# EAGLE design ATSAMR21-Breakout (EAGLE 7.2.0)
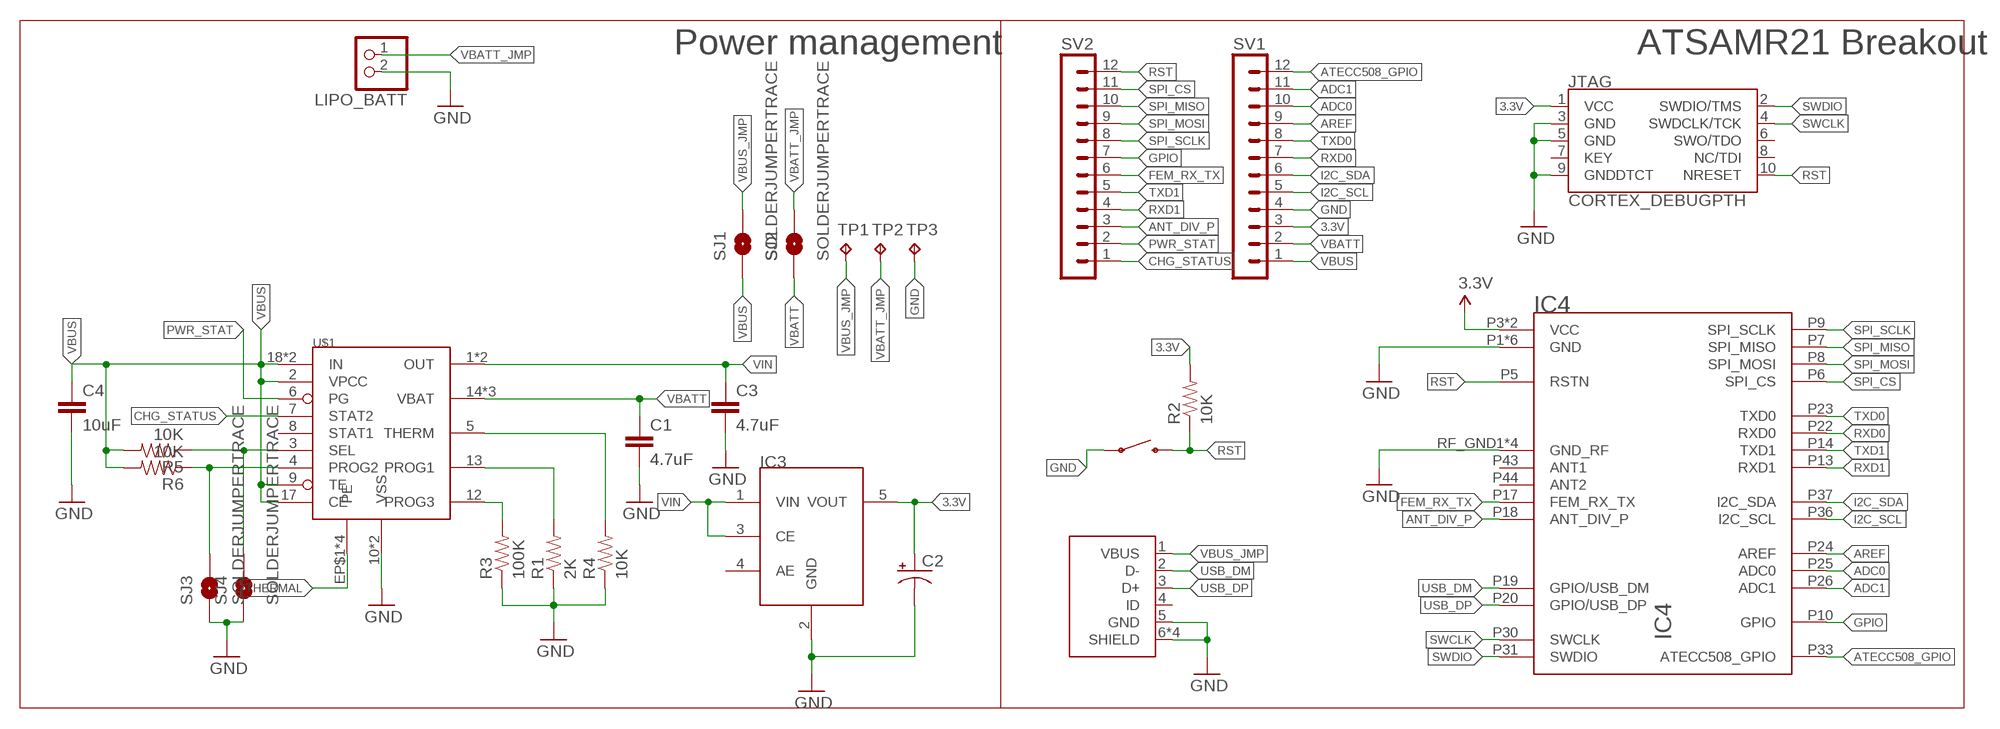
[diagram p0: schematic, sheet 1]

## Parts
C1  4.7uF  22UF-0805-6.3V-20%  [0805]
C2  47uF  TPSB107M010R0400  [1210-POLARIZED]
C3  4.7uF  22UF-0805-6.3V-20%  [0805]
C4  10uF  22UF-0805-6.3V-20%  [0805]
IC3  NCP4589DSN33T1G  [SOT23-5]
IC4  ATSAMR21G18-MR210UA  [ATSAMR21G18A-MR210UA]
JTAG  CORTEX_DEBUGPTH  [2X5-PTH-1.27MM]
LIPO_BATT  JST_2PIN-THM-RA  [JST-PH-2-THM-RA]
R1  2K  RESISTOR0805-RES  [0805]
R2  10K  RESISTOR0805-RES  [0805]
R3  100K  RESISTOR0805-RES  [0805]
R4  10K  RESISTOR0805-RES  [0805]
R5  10K  RESISTOR0805-RES  [0805]
R6  10K  RESISTOR0805-RES  [0805]
S1  EVQ-PNF04M  [PANASONIC_EVQPE1/PN/5P]
SJ1  SOLDERJUMPERTRACE  [SJ_2S-TRACE]
SJ2  SOLDERJUMPERTRACE  [SJ_2S-TRACE]
SJ3  SOLDERJUMPERTRACE  [SJ_2S-TRACE]
SJ4  SOLDERJUMPERTRACE  [SJ_2S-TRACE]
SV1  MA12-1  [MA12-1]
SV2  MA12-1  [MA12-1]
TP1  TPB2,54  [B2,54]
TP2  TPB2,54  [B2,54]
TP3  TPB2,54  [B2,54]
U$1  MCP73871T  [QFN-20]
USB_CONN  USB-MICRO-B  [HPL511]

## Nets
3.3V: C2.1(+) IC3.5(VOUT) IC4.P3(VCC) IC4.P4(VCC) JTAG.1(VCC) R2.2 SV1.3
ADC0: IC4.P25(ADC0) SV1.10
ADC1: IC4.P26(ADC1) SV1.11
ANT_DIV_P: IC4.P18(ANT_DIV_P) SV2.3
AREF: IC4.P24(AREF) SV1.9
ATECC508_GPIO: IC4.P33(ATECC508_GPIO) SV1.12
CHG_STATUS: SV2.1 U$1.7(STAT2)
FEM_RX_TX: IC4.P17(FEM_RX_TX) SV2.6
GND: C1.2 C2.2(-) C3.2 C4.2 IC3.2(GND) IC4.P1(GND) IC4.P2(GND) IC4.P12(GND) IC4.P29(GND) IC4.P41(GND) IC4.P42(GND) IC4.RF_GND1(GND_RF) IC4.RF_GND2(GND_RF) IC4.RF_GND3(GND_RF) IC4.RF_GND4(GND_RF) JTAG.3(GND) JTAG.5(GND) JTAG.9(GNDDTCT) LIPO_BATT.2 R1.1 R3.1 R4.1 S1.P1 SJ3.1 SJ4.1 SV1.4 TP3.TP U$1.10(VSS) U$1.11(VSS) USB_CONN.5(GND) USB_CONN.6(SHIELD) USB_CONN.7(SHIELD) USB_CONN.8(SHIELD) USB_CONN.9(SHIELD)
GPIO: IC4.P10(GPIO) SV2.7
I2C_SCL: IC4.P36(I2C_SCL) SV1.5
I2C_SDA: IC4.P37(I2C_SDA) SV1.6
N$1: R6.1 SJ3.2 U$1.4(PROG2)
N$2: R5.1 SJ4.2 U$1.3(SEL)
N$3: R3.2 U$1.12(PROG3)
N$4: R1.2 U$1.13(PROG1)
N$5: R4.2 U$1.5(THERM)
PWR_STAT: SV2.2 U$1.6(PG)
RST: IC4.P5(RSTN) JTAG.10(NRESET) R2.1 S1.P2 SV2.12
RXD0: IC4.P22(RXD0) SV1.7
RXD1: IC4.P13(RXD1) SV2.4
SPI_CS: IC4.P6(SPI_CS) SV2.11
SPI_MISO: IC4.P7(SPI_MISO) SV2.10
SPI_MOSI: IC4.P8(SPI_MOSI) SV2.9
SPI_SCLK: IC4.P9(SPI_SCLK) SV2.8
SWCLK: IC4.P30(SWCLK) JTAG.4(SWDCLK/TCK)
SWDIO: IC4.P31(SWDIO) JTAG.2(SWDIO/TMS)
THERMAL: U$1.EP$1(PE) U$1.EP$2(PE) U$1.EP$3(PE) U$1.EP$4(PE)
TXD0: IC4.P23(TXD0) SV1.8
TXD1: IC4.P14(TXD1) SV2.5
USB_DM: IC4.P19(GPIO/USB_DM) USB_CONN.2(D-)
USB_DP: IC4.P20(GPIO/USB_DP) USB_CONN.3(D+)
VBATT: C1.1 SJ2.1 SV1.2 U$1.14(VBAT) U$1.15(VBAT) U$1.16(VBAT)
VBATT_JMP: LIPO_BATT.1 SJ2.2 TP2.TP
VBUS: C4.1 R5.2 R6.2 SJ1.1 SV1.1 U$1.2(VPCC) U$1.9(TE) U$1.17(CE) U$1.18(IN) U$1.19(IN)
VBUS_JMP: SJ1.2 TP1.TP USB_CONN.1(VBUS)
VIN: C3.1 IC3.1(VIN) IC3.3(CE) U$1.1(OUT) U$1.20(OUT)
Unconnected: IC3.4(AE) IC4.P43(ANT1) IC4.P44(ANT2) JTAG.6(SWO/TDO) JTAG.7(KEY) JTAG.8(NC/TDI) U$1.8(STAT1) USB_CONN.4(ID)

## Notes on the sheet
- Power management | ATSAMR21 Breakout

## Library data of the parts
C1 C3 C4 = SparkFun-Capacitors:22UF: 22µF ceramic capacitors A capacitor is a passive two-terminal electrical component used to store electrical energy temporarily in an electric field.; PROD_ID: CAP-08402; VALUE: 22uF
C2 = custom_componentsv0.9:TPSB107M010R0400
IC3 = radios:NCP4589DSN33T1G
IC4 = radios:ATSAMR21G18-MR210UA
JTAG = SparkFun-Connectors:CORTEX_DEBUG: Cortex Debug Connector Datasheet <http://infocenter.arm.com/help/topic/com.arm.doc.faqs/attached/13634/cortex_debug_connectors.pdf>
LIPO_BATT = adafruit:JST_2PIN: JST 2-Pin Connectors of various flavors SMT-RA (S2B-PH-SM4) 4UConnector #17311 SMT (B2B-PH-SM4) THM-RA (S2B-PH) THM (B2B-PH)
R1-R6 = SparkFun-Resistors:RESISTOR: Resistor Basic schematic elements and footprints for 0603, 1206, and PTH resistors.
S1 = radios:EVQ-PNF04M
SJ1-SJ4 = SparkFun-Retired:SOLDERJUMPER: Solder Jumper Standard SMD solder jumper. Used to automate production. Two varients : Normally Open and Normally Closed are the same, but have different paste layers. NC will have a large amount of paste and should jumper during reflow.
SV1 SV2 = con-lstb:MA12-1: PIN HEADER; OC_FARNELL: unknown; OC_NEWARK: unknown
TP1-TP3 = testpad:TP: Test pad
U$1 = radios:MCP73871T
USB_CONN = gpsinfopatch:USB-MICRO-B

## Board
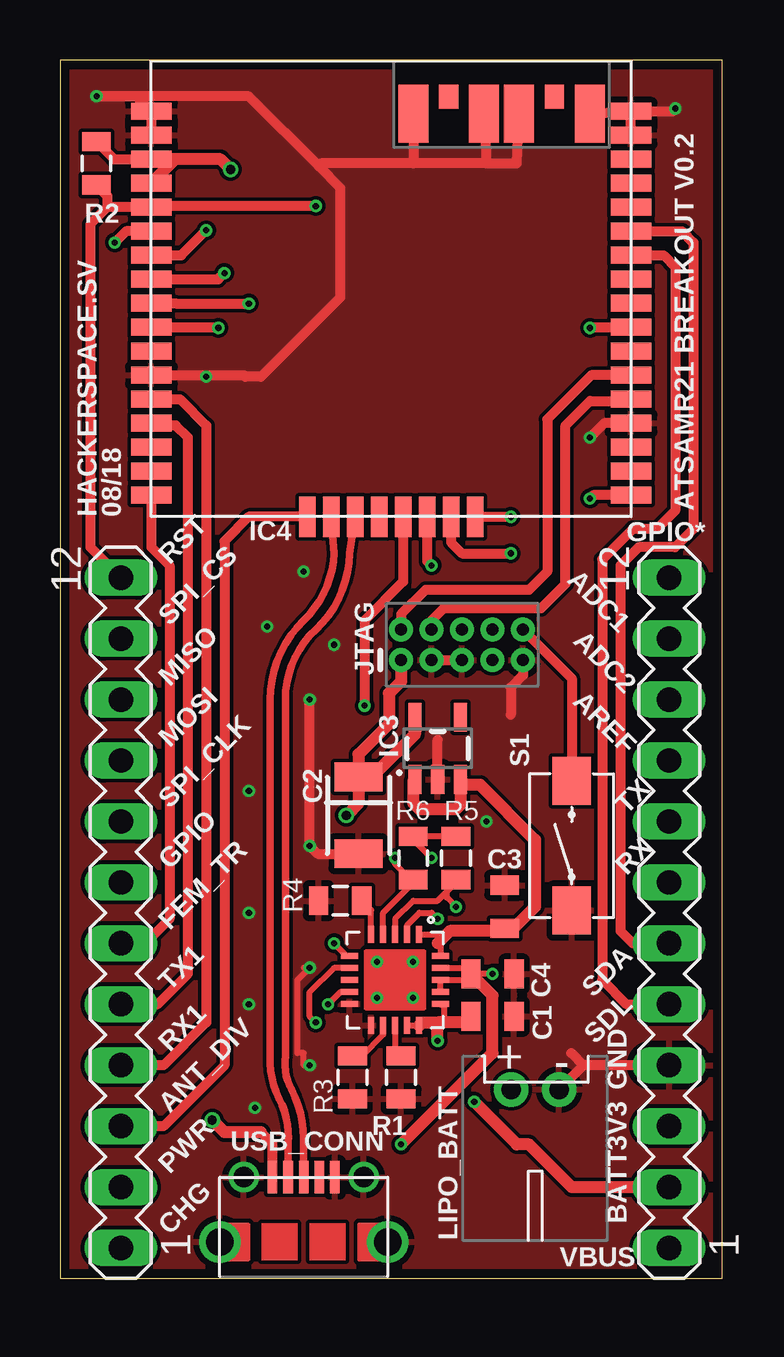
[diagram p1: board, top side]
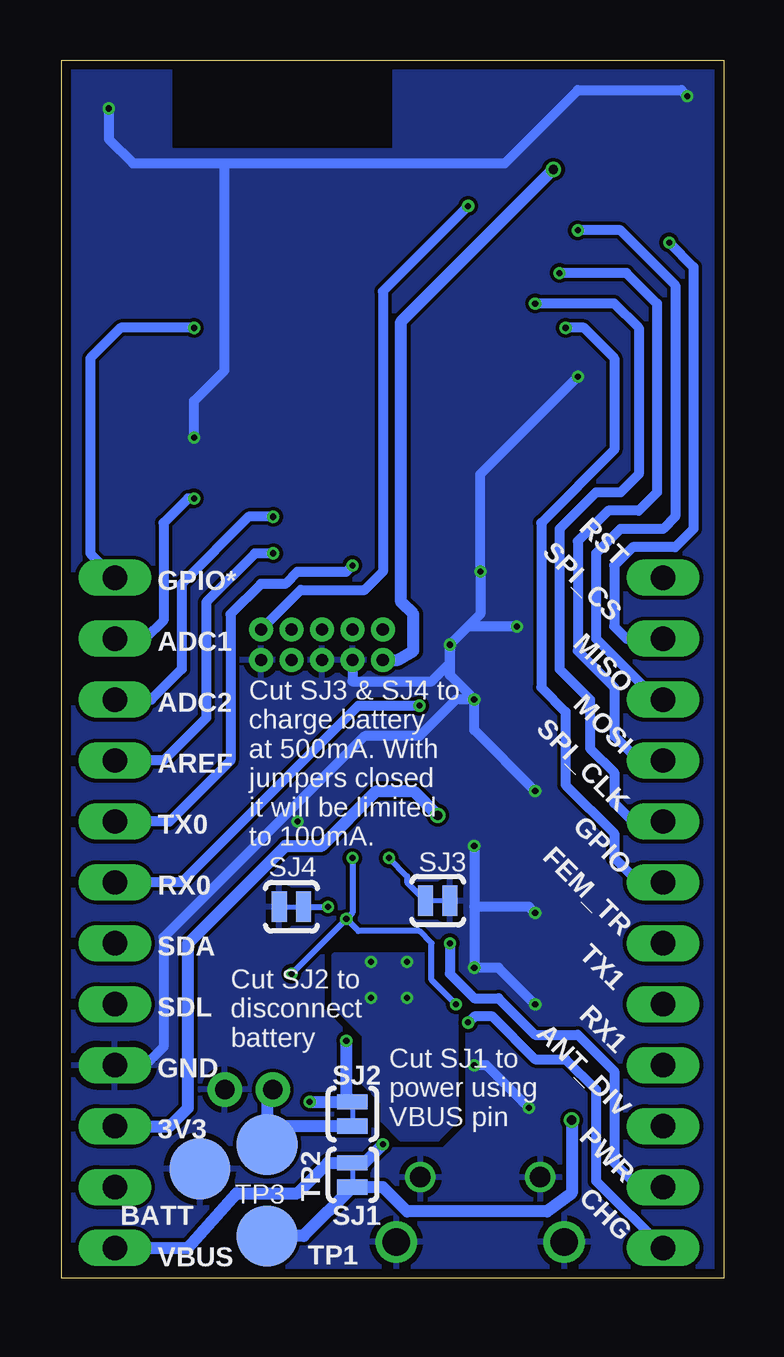
[diagram p2: board, bottom side, seen from below]

Size 27.61 x 50.79 mm. Coordinates in mm from the lower left corner, seen from the top.
Outline: 0,0 27.61,0 27.61,50.79 0,50.79 0,0
Copper layers (1*16): Top 0.035559375mm / dielectric 1.6mm / Bottom 0.035559375mm
Design rules "oshpark-2layer": minimum track width 6mil, minimum drill 10mil, track to track 6mil, track to pad 6mil, pad to pad 6mil, via to via 6mil, smd to smd 6mil, copper to edge 15mil, drill to drill 6mil, minimum pad ring 5mil, minimum via ring 5mil, stop-mask expansion 2.5mil, vias tented up to drill 0mil, thermal gap 10mil

### Footprints (pad centres in the part's own frame; a part is rotated, then mirrored left to right if it is on the bottom)
0805 = smd 0.8 x 1.2: 1 -0.9,0; 2 0.9,0
1210-POLARIZED = smd 1.2 x 2: 1 -1.6,0; 2 1.6,0
SOT23-5 = smd 0.55 x 1.2: 1 -0.95,-1.3; 2 0,-1.3; 3 0.95,-1.3; 4 0.95,1.3; 5 -0.95,1.3
ATSAMR21G18A-MR210UA = smd 1.7 x 0.7: P1 0,16.9; P2 0,15.9; P3 0,14.9; P4 0,13.9; P5 0,12.9; P6 0,11.9; P7 0,10.9; P8 0,9.9; P9 0,8.9; P10 0,7.9; P11 0,6.9; P12 0,5.9; P13 0,4.9; P14 0,3.9; P15 0,2.9; P16 0,1.9; P17 0,0.9; P26 20,0.9; P27 20,1.9; P28 20,2.9; P29 20,3.9; P30 20,4.9; P31 20,5.9; P32 20,6.9; P33 20,7.9; P34 20,8.9; P35 20,9.9; P36 20,10.9; P37 20,11.9; P38 20,12.9; P39 20,13.9; P40 20,14.9; P41 20,15.9; P42 20,16.9 | smd 0.7 x 1.7: P18 6.5,0; P19 7.5,0; P20 8.5,0; P21 9.5,0; P22 10.5,0; P23 11.5,0; P24 12.5,0; P25 13.5,0 | smd 0.8 x 1: P43 16.8,17.5; P44 12.4,17.5 | smd 1.25 x 2.4: RF_GND1 18.275,16.8; RF_GND2 15.325,16.8; RF_GND3 13.875,16.8; RF_GND4 10.925,16.8
2X5-PTH-1.27MM = drill 0.508 pad 1: 1 -2.54,-0.635; 2 -2.54,0.635; 3 -1.27,-0.635; 4 -1.27,0.635; 5 0,-0.635; 6 0,0.635; 7 1.27,-0.635; 8 1.27,0.635; 9 2.54,-0.635; 10 2.54,0.635
JST-PH-2-THM-RA = drill 0.8 pad 1.422: 1 1,0; 2 -1,0
PANASONIC_EVQPE1/PN/5P = smd 2 x 1.6: P1 -2.7,0; P2 2.7,0
SJ_2S-TRACE = smd 0.635 x 1.27: 1 -0.508,0; 2 0.508,0
MA12-1 = drill 1.016 long: 1 -13.97,0; 2 -11.43,0; 3 -8.89,0; 4 -6.35,0; 5 -3.81,0; 6 -1.27,0; 7 1.27,0; 8 3.81,0; 9 6.35,0; 10 8.89,0; 11 11.43,0; 12 13.97,0
B2,54 = smd 2.54 x 2.54: TP 0,0
QFN-20 = smd 0.7 x 0.25: 1 -1.9,1; 2 -1.9,0.5; 3 -1.9,0; 4 -1.9,-0.5; 5 -1.9,-1; 11 1.9,-1; 12 1.9,-0.5; 13 1.9,0; 14 1.9,0.5; 15 1.9,1 | smd 0.25 x 0.7: 6 -1,-1.9; 7 -0.5,-1.9; 8 0,-1.9; 9 0.5,-1.9; 10 1,-1.9; 16 1,1.9; 17 0.5,1.9; 18 0,1.9; 19 -0.5,1.9; 20 -1,1.9 | drill 0.254 pad 0.381: EP$1 -0.75,0.75; EP$2 -0.75,-0.75; EP$3 0.75,-0.75; EP$4 0.75,0.75
HPL511 = smd 0.4 x 1.35: 1 -1.3,2.7; 2 -0.65,2.7; 3 0,2.7; 4 0.65,2.7; 5 1.3,2.7 | drill 1.15 pad 1.55: 6 -3.5,0; 7 3.5,0 | drill 0.85 pad 1.25: 8 -2.5,2.7; 9 2.5,2.7

### Placement (x,y rotation side)
C1  18.03,10.92 0 top
C2  12.45,19.3 270 top
C3  18.54,15.49 90 top
C4  18.03,12.7 0 top
IC3  15.75,22.1 0 top
IC4  3.81,31.75 0 top
JTAG  16.76,26.42 0 top
LIPO_BATT  19.81,7.87 180 top
R1  14.22,8.38 90 top
R2  1.52,46.48 90 top
R3  12.19,8.38 90 top
R4  11.68,15.75 0 top
R5  16.51,17.53 90 top
R6  14.73,17.53 90 top
S1  21.34,18.03 90 top
SJ1  15.49,4.32 270 bottom
SJ2  15.49,6.86 270 bottom
SJ3  11.94,15.75 180 bottom
SJ4  18.03,15.49 0 bottom
SV1  25.4,15.24 90 top
SV2  2.54,15.24 90 top
TP1  19.05,1.78 0 bottom
TP2  19.05,5.59 0 bottom
TP3  21.84,4.57 0 bottom
U$1  13.97,12.45 270 top
USB_CONN  10.16,1.52 0 top

### Tracks (layer width: path | path; a pad name or v marks a point on that pad's centre or on a via)
3.3V  (via drill 0.38)
  Top 0.406: 12.7,21.16 C2.1 12.19,21.16 | R2.2 2.26,46.65 IC4.P3
  Top 0.508: v7.11,46.23 6.69,46.65 4.81,46.65 | 4.81,46.65 IC4.P3 | IC4.P4 4.81,46.65 | C2.1 12.45,19.81 v11.94,19.3 | IC3.5 14.8,22.67 13.21,21.08 12.62,21.08 C2.1 | JTAG.1 14.22,24.89 13.72,24.38 13.72,23.11 12.45,21.84 C2.1
  Bottom 0.508: JTAG.1 13.59,25.78 12.95,26.16 12.95,27.69 13.46,28.19 13.46,39.88 v7.11,46.23 | SV1.3 23.11,6.35 22.35,7.11 22.35,13.97 18.29,18.03 16.76,18.03 14.48,20.32 12.95,20.32 v11.94,19.3
ADC0  (via drill 0.25)
  Top 0.406: IC4.P25 v18.8,31.75
  Bottom 0.406: v18.8,31.75 19.81,31.75 22.61,28.96 22.61,25.4 23.88,24.13 SV1.10
ADC1  (via drill 0.25)
  Top 0.406: IC4.P26 22.24,32.65 v22.1,32.51
  Bottom 0.406: v22.1,32.51 22.35,32.51 23.37,31.5 23.37,27.43 24.13,26.67 SV1.11
ANT_DIV_P
  Top 0.406: IC4.P18 7.87,31.75 6.86,30.73 6.86,8.89 4.32,6.35 SV2.3
AREF  (via drill 0.25)
  Top 0.406: IC4.P24 16.31,30.68 16.76,30.23 v18.8,30.23
  Bottom 0.406: v18.8,30.23 19.56,30.23 21.59,28.19 21.59,23.37 23.37,21.59 SV1.9
ATECC508_GPIO  (via drill 0.25)
  Top 0.406: IC4.P33 23.78,39.62 v22.1,39.62
  Bottom 0.406: v22.1,39.62 25.15,39.62 26.42,38.35 26.42,30.23 SV1.12
CHG_STATUS  (via drill 0.25)
  Top 0.254: U$1.7 11.42,12.95 10.41,11.94 10.41,10.92 v10.67,10.67
  Bottom 0.406: SV2.1 5.33,4.06 5.33,7.87 6.6,9.14 7.87,9.14 9.65,10.92 10.41,10.92 v10.67,10.67
FEM_RX_TX
  Top 0.406: IC4.P17 3.81,30.48 4.57,29.72 4.57,14.99 3.56,13.97 SV2.6
GND  (via drill 0.25)
  Top 0.254: 25.54,48.65 v25.65,48.77 | v10.41,8.89 10.16,8.89 10.16,9.4 9.91,9.4 9.91,12.45 v10.41,12.95 10.16,12.95
  Top 0.406: IC4.P29 22.7,35.65 v22.1,35.05 | IC4.P12 6.04,37.65 | 6.04,37.65 v6.1,37.59 | SV1.4 21.83,8.89 | 21.32,9.4 21.83,8.89 | IC4.P2 IC4.P1 3.18,49.28 v1.52,49.28 7.87,49.28 10.79,46.35 | IC4.P42 25.54,48.65 | IC4.P41 IC4.P42 | 6.04,37.65 7.68,37.65 7.74,37.59 8.38,37.59 11.68,40.89 11.68,45.47 10.79,46.35 | JTAG.9 19.3,25.15 18.8,24.64 18.8,23.51 | IC3.2 15.75,22.45 | JTAG.3 JTAG.5 | C2.2 10.74,17.7 v10.41,18.03 v10.41,24.13 | LIPO_BATT.2 21.83,8.89 | IC4.RF_GND1 IC4.P42 | IC4.RF_GND3 17.78,46.48 | 17.78,46.48 19.05,46.48 IC4.RF_GND2 | 17.78,46.48 14.73,46.48 | 14.73,46.48 10.92,46.48 arc90 10.79,46.35 | IC4.RF_GND4 14.73,46.48
  Bottom 0.406: v25.65,48.77 25.65,47.5 24.64,46.48 20.83,46.48 | 20.83,46.48 9.14,46.48 6.1,49.53 1.78,49.53 v1.52,49.28 | v22.1,35.05 22.1,36.58 20.83,37.85 20.83,46.48 | JTAG.3 15.49,24.89 12.19,24.89 11.43,25.65 v11.43,26.42 | v8.64,27.18 10.67,27.18 | 10.67,27.18 v11.43,26.42 | 10.67,27.18 10.16,27.69 v10.16,29.46 10.16,33.53 v6.1,37.59 | v10.41,18.03 10.41,15.49 | 10.41,15.49 v10.41,12.95 9.4,12.95 v7.87,11.43 | v7.87,15.24 8.13,15.49 10.41,15.49 | v8.13,7.11 9.91,8.89 v10.41,8.89 | v10.41,24.13 11.18,24.13 12.7,22.61 14.99,22.61 23.37,14.22 23.37,9.65 24.13,8.89 SV1.4 | v11.43,26.42 11.43,25.15 v10.41,24.13 | v7.87,20.32 10.41,22.86 v10.41,24.13
  other vias: 17.78,19.05
  pour Bottom: 0,50.8 13.72,50.8 13.72,46.99 23.11,46.99 23.11,50.8 27.69,50.8 27.69,13.97 0,13.97
  pour Bottom: 0.51,13.97 10.92,13.97 11.43,13.46 11.43,12.45 10.67,11.68 10.67,6.35 11.68,5.33 13.72,5.33 14.73,6.35 14.73,7.11 15.49,7.87 15.49,9.91 16.76,11.18 16.76,13.97 27.69,13.97 27.69,0 0,0 0,13.97
  pour Top: 0,0 0,50.8 13.72,50.8 13.72,46.99 23.11,46.99 23.11,50.8 27.69,50.8 27.69,0.25 27.69,0
GPIO  (via drill 0.25)
  Top 0.406: IC4.P10 6.58,39.65 v6.6,39.62
  Bottom 0.406: v6.6,39.62 5.84,39.62 4.57,38.35 4.57,34.54 7.62,31.5 7.62,24.64 6.6,23.62 6.6,20.57 4.57,18.54 4.57,17.53 3.56,16.51 SV2.7
I2C_SCL
  Top 0.406: IC4.P36 25.17,42.65 25.65,42.16 25.65,32 24.89,31.24 23.88,31.24 22.61,29.97 22.61,12.45 23.62,11.43 SV1.5
I2C_SDA
  Top 0.406: IC4.P37 25.95,43.65 26.42,43.18 26.42,31.24 25.65,30.48 24.13,30.48 23.37,29.72 23.37,14.48 23.88,13.97 SV1.6
N$1  (via drill 0.25)
  Top 0.254: U$1.4 13.47,15.25 14.73,16.51 | 14.73,16.51 R6.1 | 14.73,16.51 13.97,17.27 v13.97,17.53
  Bottom 0.254: SJ3.2 13.21,16.51 13.21,16.76 v13.97,17.53
N$2  (via drill 0.25)
  Top 0.254: U$1.3 13.97,14.99 14.73,15.75 15.75,15.75 16,16 16.13,16.13 | v16.51,15.49 16.13,15.88 16.13,16.13 | R5.1 16.51,16.51 16.13,16.13
  Bottom 0.254: SJ4.2 v16.51,15.49
N$3
  Top 0.254: R3.2 12.58,9.28 13.47,10.17 U$1.12
N$4
  Top 0.254: U$1.13 13.97,9.54 R1.2
N$5
  Top 0.254: U$1.5 12.97,15.36 R4.2
PWR_STAT  (via drill 0.25)
  Top 0.254: U$1.6 11.95,13.45 v11.43,13.97
  Bottom 0.406: v11.43,13.97 11.43,12.7 10.41,11.68 9.4,11.68 7.87,10.16 6.1,10.16 4.57,8.64 4.57,4.83 3.56,3.81 SV2.2
RST  (via drill 0.25)
  Top 0.406: 1.98,44.65 IC4.P5 3.86,44.7 v10.67,44.7 | 1.98,44.65 1.27,43.94 1.27,30.48 SV2.12 | R2.1 1.98,45.13 1.98,44.65 | JTAG.10 21.34,25.02 S1.P2
  Bottom 0.406: JTAG.10 17.65,28.7 14.99,28.7 14.22,29.46 14.22,41.15 v10.67,44.7
RXD0  (via drill 0.25)
  Top 0.406: IC4.P22 14.31,29.04 12.7,27.43 v12.7,23.88
  Bottom 0.406: SV1.7 22.61,16.51 15.24,23.88 v12.7,23.88
RXD1
  Top 0.406: IC4.P13 5.01,36.65 6.1,35.56 6.1,10.67 4.32,8.89 SV2.4
SPI_CS  (via drill 0.25)
  Top 0.406: IC4.P6 2.76,43.65 v2.29,43.18
  Bottom 0.406: v2.29,43.18 1.27,42.16 1.27,31.24 2.03,30.48 3.81,30.48 4.57,29.72 4.57,27.18 4.06,26.67 SV2.11
SPI_MISO  (via drill 0.25)
  Top 0.406: IC4.P7 5.06,42.65 v6.1,43.69
  Bottom 0.406: v6.1,43.69 4.32,43.69 2.03,41.4 2.03,31.75 2.54,31.24 4.32,31.24 5.33,30.23 5.33,26.67 2.79,24.13 SV2.10
SPI_MOSI  (via drill 0.25)
  Top 0.406: IC4.P8 6.6,41.65 v6.86,41.91
  Bottom 0.406: v6.86,41.91 4.06,41.91 2.79,40.64 2.79,32.77 3.56,32 4.83,32 6.1,30.73 6.1,26.16 4.57,24.64 4.57,22.61 3.56,21.59 SV2.9
SPI_SCLK  (via drill 0.25)
  Top 0.406: IC4.P9 4.82,40.65 4.83,40.64 v7.87,40.64
  Bottom 0.406: v7.87,40.64 4.57,40.64 3.56,39.62 3.56,33.53 4.32,32.77 5.33,32.77 6.86,31.24 6.86,25.4 5.59,24.13 5.59,22.1 4.57,21.08 4.57,19.81 3.81,19.05 SV2.8
SWCLK
  Top 0.406: JTAG.4 15.49,27.43 16,27.94 20.07,27.94 21.08,28.96 21.08,35.56 22.1,36.58 23.74,36.58 IC4.P30
SWDIO
  Top 0.406: IC4.P31 22.16,37.65 20.32,35.81 20.32,29.46 19.56,28.7 15.24,28.7 14.22,27.69 JTAG.2
THERMAL
  pour Bottom (no thermals): 11.94,13.46 16.26,13.46 16.26,11.43 14.99,10.16 14.99,8.13 14.22,7.37 14.22,6.6 13.46,5.84 11.94,5.84 11.18,6.6 11.18,11.43 11.94,12.19
TXD0  (via drill 0.25)
  Top 0.406: IC4.P23 15.31,29.9 v15.49,29.72
  Bottom 0.406: SV1.8 23.11,19.05 20.57,21.59 20.57,27.69 19.3,28.96 18.29,28.96 17.78,29.46 15.75,29.46 v15.49,29.72
TXD1
  Top 0.406: SV2.5 4.06,11.43 5.33,12.7 5.33,35.05 4.83,35.56 3.9,35.56 IC4.P14
USB_DM
  Top 0.305: IC4.P19 11.43,30.23 arc-43 10.16,27.43 arc46 8.76,24.13 8.76,9.27 arc29 9.14,7.49 arc-28 9.53,5.84 arc90 9.51,5.83 USB_CONN.2
USB_DP
  Top 0.305: IC4.P20 12.06,30.23 arc-46 10.67,27.05 arc47 9.4,24.13 9.4,9.27 arc36 9.65,7.87 arc-28 10.16,5.84 USB_CONN.3
VBATT  (via drill 0.25)
  Top 0.254: U$1.14 U$1.15 | U$1.16 16,11.31 16,10.67
  Top 0.508: SV1.2 21.34,3.81 19.56,5.59 19.05,5.59 v17.27,7.37 | v15.75,9.91 15.75,10.67 | C1.1 16.88,10.67 16,10.67 15.75,10.67 | U$1.15 15.09,10.67 15.75,10.67
  Bottom 0.508: v17.27,7.37 SJ2.1 15.75,7.62 v15.75,9.91
VBATT_JMP
  Bottom 0.508: SJ2.2 18.29,6.35 TP2.TP 19.05,7.64 LIPO_BATT.1
VBUS  (via drill 0.25)
  Top 0.254: U$1.17 U$1.18 16.88,12.45 C4.1 | U$1.2 14.47,14.72 14.99,15.24 15.49,15.24 v15.75,14.99 | v18.03,12.7 C4.1 | U$1.19 16.89,12.95 C4.1 | R5.2 R6.2 14.73,18.29 v15.49,17.53 | U$1.9 11.69,11.95 v11.18,11.43
  Top 0.508: v14.22,5.59 18.03,9.4 18.03,11.8 C4.1
  Bottom 0.254: v15.75,14.99 v18.03,12.7 | v15.49,17.53 15.49,15.24 v15.75,14.99 | v11.18,11.43 12.19,12.45 12.19,13.97 12.7,14.48 15.24,14.48 v15.75,14.99
  Bottom 0.508: SV1.1 22.35,1.27 20.32,3.56 17.78,3.56 16.51,4.83 SJ1.1 14.99,4.83 v14.22,5.59
VBUS_JMP  (via drill 0.38)
  Top 0.406: 8.38,6.1 8.86,5.62 USB_CONN.1
  Top 0.508: 8.38,6.1 6.86,6.1 v6.35,6.6
  Bottom 0.508: v6.35,6.6 6.35,3.56 7.37,2.79 13.21,2.79 14.22,3.81 SJ1.2 17.53,1.78 TP1.TP
VIN
  Top 0.254: U$1.20 15.87,13.85 15.75,13.97 15.75,14.35 U$1.1
  Top 0.508: 15.75,13.97 16.26,14.48 18.43,14.48 C3.1 18.91,14.59 19.81,15.49 19.81,18.29 17.53,20.57 16.92,20.57 IC3.3 16.7,19.75 16.51,19.56 14.99,19.56 14.73,19.81 14.73,20.73 IC3.1

### Text on the board
bPlace: Cut SJ3 & SJ4 to / charge battery / at 500mA. With / jumpers closed / it will be limited / to 100mA. | Cut SJ2 to / disconnect / battery | Cut SJ1 to / power using / VBUS pin
tNames: HACKERSPACE.SV | 08/18 | ATSAMR21 BREAKOUT V0.2 | GPIO* | RST | SPI_CS | ADC1 | MISO | ADC2 | MOSI | AREF | SPI_CLK | TX | GPIO | RX | FEM_TR | SDA | TX1 | SDL | RX1 | GND | ANT_DIV | 3V3 | PWR | CHG | BATT | VBUS
bNames: RST | SPI_CS | GPIO* | MISO | ADC1 | MOSI | ADC2 | SPI_CLK | AREF | GPIO | TX0 | FEM_TR | RX0 | TX1 | SDA | RX1 | SDL | ANT_DIV | GND | PWR | 3V3 | CHG | BATT | VBUS